# EAGLE design gtia_adapter (EAGLE 7.3.0)
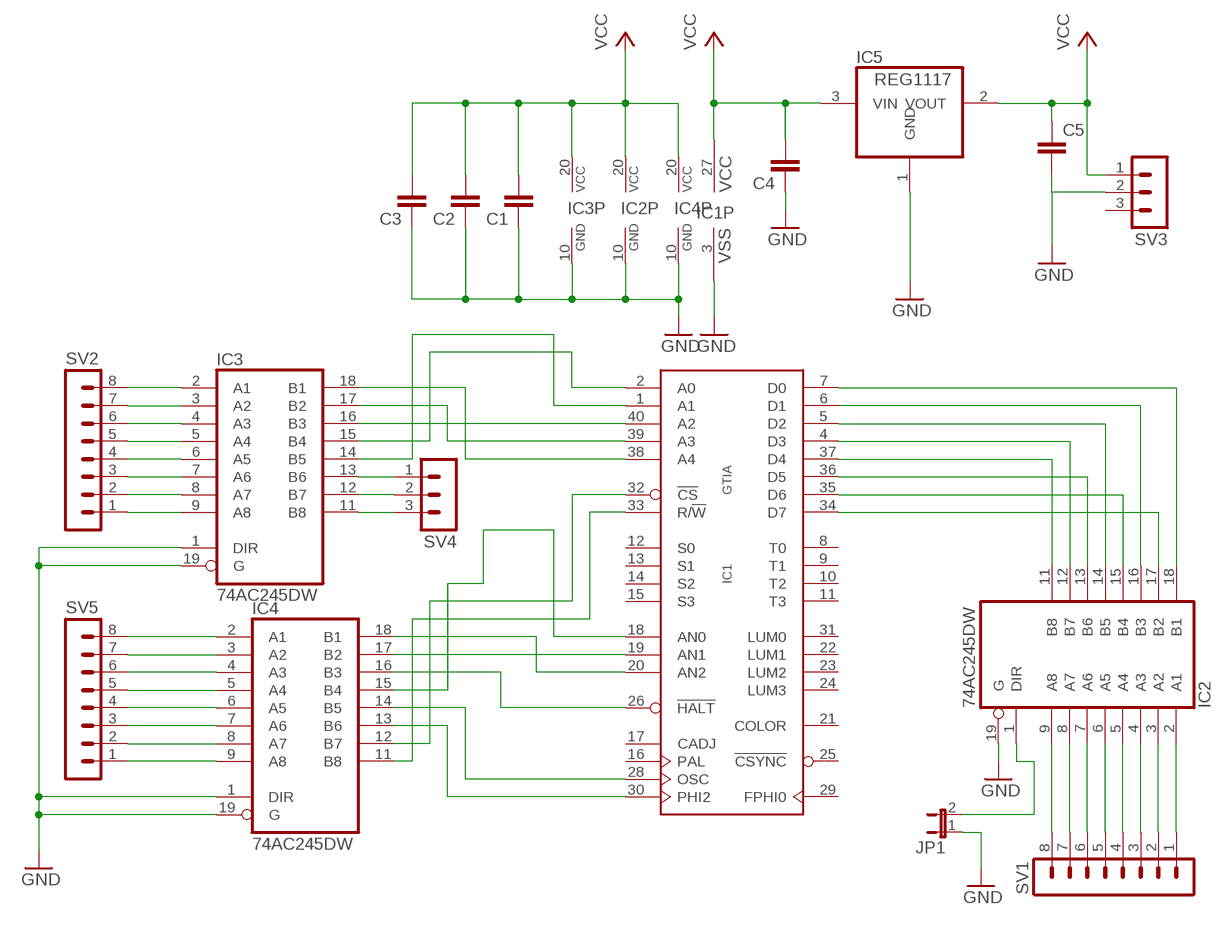
[diagram p0: schematic, sheet 1]

## Parts
C1  C-EUC1206  [C1206]
C2  C-EUC1206  [C1206]
C3  C-EUC1206  [C1206]
C4  C-EUC1206  [C1206]
C5  C-EUC1206  [C1206]
IC1  GTIA  [DIL40]
IC2  74AC245DW  [SO20W]
IC3  74AC245DW  [SO20W]
IC4  74AC245DW  [SO20W]
IC5  REG1117  [SOT223]
JP1  JP1E  [JP1]
SV1  MA08-1  [MA08-1]
SV2  MA08-1  [MA08-1]
SV3  MA03-1  [MA03-1]
SV4  MA03-1  [MA03-1]
SV5  MA08-1  [MA08-1]

## Nets
3.3V_VCC: C1.2 C2.2 C3.2 C5.1 IC2.20(VCC) IC3.20(VCC) IC4.20(VCC) IC5.2(VOUT) SV3.1 ; supply symbol labelled VCC
5V_VCC: C4.2 IC1.27(VCC) IC5.3(VIN) ; supply symbol labelled VCC
GND: C1.1 C2.1 C3.1 C4.1 C5.2 IC1.3(VSS) IC2.10(GND) IC2.19(G) IC3.1(DIR) IC3.10(GND) IC3.19(G) IC4.1(DIR) IC4.10(GND) IC4.19(G) IC5.1(GND) JP1.1 SV3.2
N$1: IC1.18(AN0) IC4.15(B4)
N$2: IC1.19(AN1) IC4.17(B2)
N$3: IC1.20(AN2) IC4.18(B1)
N$4: IC1.2(A0) IC3.15(B4)
N$5: IC1.1(A1) IC3.14(B5)
N$6: IC1.7(D0) IC2.18(B1)
N$7: IC1.6(D1) IC2.16(B3)
N$8: IC1.35(D6) IC2.15(B4)
N$9: IC1.36(D5) IC2.13(B6)
N$10: IC1.4(D3) IC2.12(B7)
N$11: IC1.5(D2) IC2.14(B5)
N$12: IC1.39(A3) IC3.17(B2)
N$13: IC1.37(D4) IC2.11(B8)
N$14: IC1.40(A2) IC3.16(B3)
N$15: IC2.2(A1) SV1.1
N$16: IC2.3(A2) SV1.2
N$17: IC1.33(R/!W) IC4.11(B8)
N$18: IC1.32(!CS) IC4.12(B7)
N$19: IC2.4(A3) SV1.3
N$20: IC1.26(!HALT) IC4.16(B3)
N$21: IC2.5(A4) SV1.4
N$22: IC2.6(A5) SV1.5
N$23: IC2.7(A6) SV1.6
N$24: IC2.8(A7) SV1.7
N$25: IC2.9(A8) SV1.8
N$26: IC1.38(A4) IC3.18(B1)
N$27: IC3.13(B6) SV4.1
N$28: IC1.34(D7) IC2.17(B2)
N$29: IC3.12(B7) SV4.2
N$30: IC3.11(B8) SV4.3
N$31: IC3.2(A1) SV2.8
N$32: IC3.3(A2) SV2.7
N$33: IC3.4(A3) SV2.6
N$34: IC3.5(A4) SV2.5
N$35: IC3.6(A5) SV2.4
N$36: IC1.28(OSC) IC4.14(B5)
N$37: IC1.30(PHI2) IC4.13(B6)
N$38: IC3.7(A6) SV2.3
N$39: IC3.8(A7) SV2.2
N$40: IC3.9(A8) SV2.1
N$41: IC4.2(A1) SV5.8
N$42: IC4.3(A2) SV5.7
N$43: IC4.4(A3) SV5.6
N$44: IC4.5(A4) SV5.5
N$45: IC4.6(A5) SV5.4
N$46: IC4.7(A6) SV5.3
N$47: IC4.8(A7) SV5.2
N$48: IC4.9(A8) SV5.1
N$49: IC2.1(DIR) JP1.2
Unconnected: IC1.8(T0) IC1.9(T1) IC1.10(T2) IC1.11(T3) IC1.12(S0) IC1.13(S1) IC1.14(S2) IC1.15(S3) IC1.16(PAL) IC1.17(CADJ) IC1.21(COLOR) IC1.22(LUM1) IC1.23(LUM2) IC1.24(LUM3) IC1.25(!CSYNC) IC1.29(FPHI0) IC1.31(LUM0) SV3.3

## Library data of the parts
C1-C5 = rcl:C-EU: CAPACITOR, European symbol
IC1 = eagle-6.5.0-atari:GTIA: GTIA
IC2-IC4 = 74xx-eu:74*245: Octal BUS TRANSCEIVER, 3-state
IC5 = burr-brown:REG1117: 800mA and 1A Low Dropout (LDO) Positive Regulator 1.8V, 2.5V, 2.85V, 3.3V, 5V, and Adj; MPN: REG1117; OC_FARNELL: 1097566; OC_NEWARK: 14P6981
JP1 = jumper:JP1E: JUMPER
SV1 SV2 SV5 = con-lstb:MA08-1: PIN HEADER; OC_FARNELL: unknown; OC_NEWARK: unknown
SV3 SV4 = con-lstb:MA03-1: PIN HEADER; OC_FARNELL: unknown; OC_NEWARK: unknown

## Board
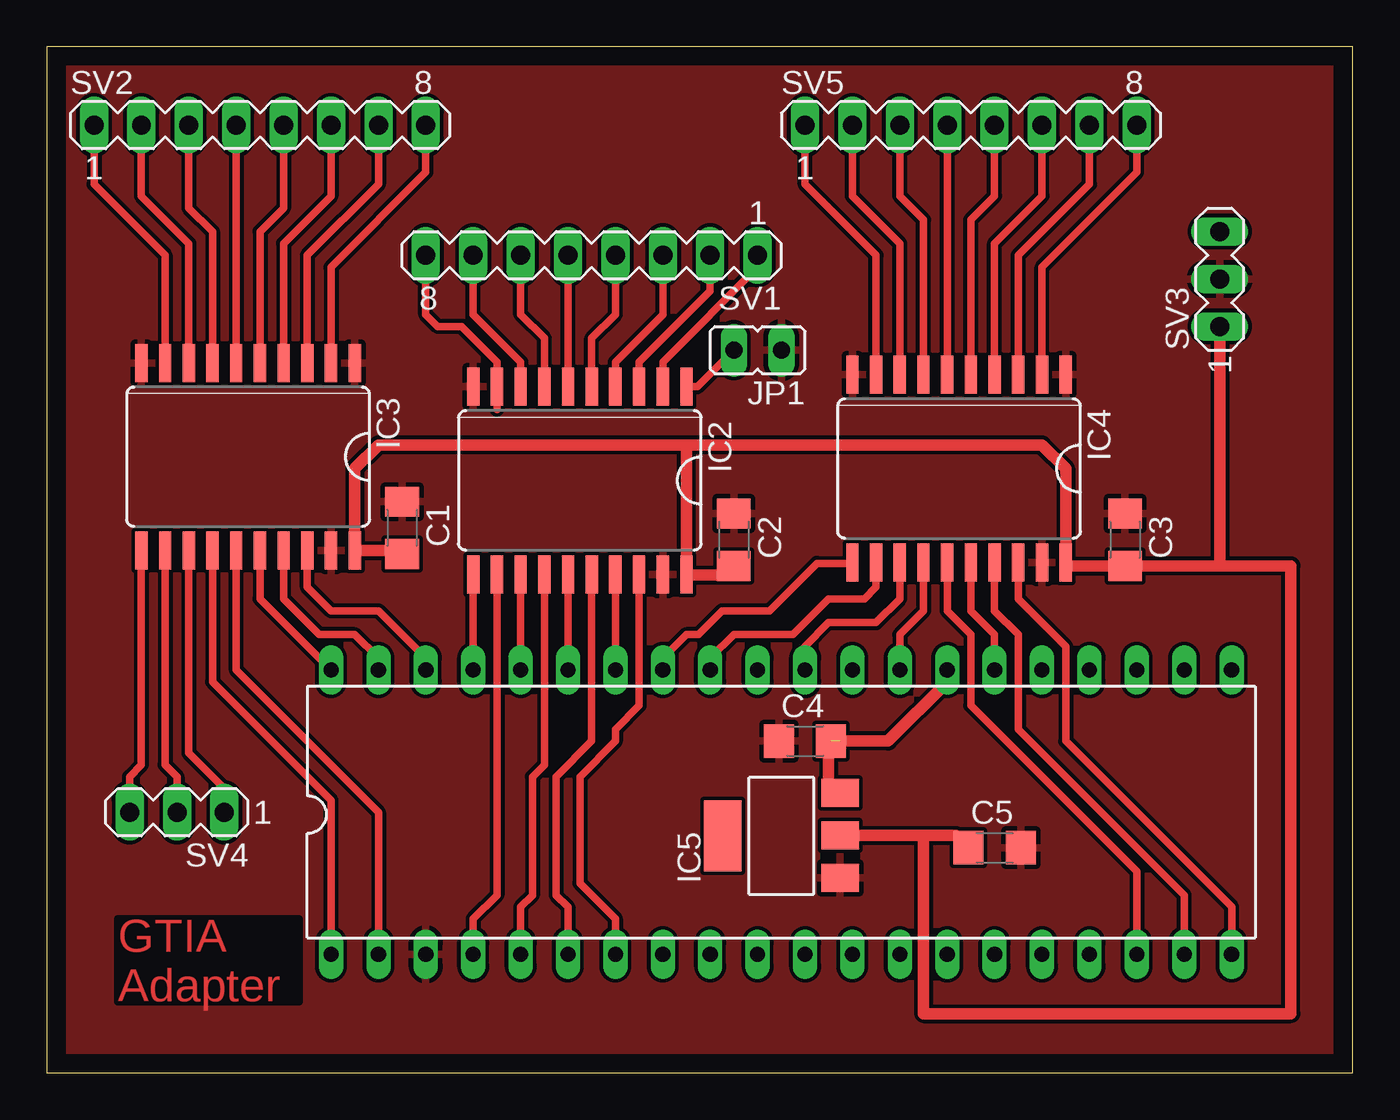
[diagram p1: board, top side]

Size 70 x 55 mm. Coordinates in mm from the lower left corner, seen from the top.
Outline: 0,0 70,0 70,55 0,55 0,0
Copper layers (1*16): Top 0.035mm / dielectric 1.5mm / Bottom 0.035mm
Design rules "default": minimum track width 10mil, minimum drill 24mil, track to track 8mil, track to pad 8mil, pad to pad 8mil, via to via 8mil, smd to smd 8mil, copper to edge 40mil, drill to drill 8mil, minimum pad ring 10mil, minimum via ring 8mil, stop-mask expansion 4mil, vias tented up to drill 0mil, thermal gap 10mil

### Footprints (pad centres in the part's own frame; a part is rotated, then mirrored left to right if it is on the bottom)
C1206 = smd 1.6 x 1.8: 1 -1.4,0; 2 1.4,0
DIL40 = drill 0.813 long: 1 -24.13,-7.62; 2 -21.59,-7.62; 3 -19.05,-7.62; 4 -16.51,-7.62; 5 -13.97,-7.62; 6 -11.43,-7.62; 7 -8.89,-7.62; 8 -6.35,-7.62; 9 -3.81,-7.62; 10 -1.27,-7.62; 11 1.27,-7.62; 12 3.81,-7.62; 13 6.35,-7.62; 14 8.89,-7.62; 15 11.43,-7.62; 16 13.97,-7.62; 17 16.51,-7.62; 18 19.05,-7.62; 19 21.59,-7.62; 20 24.13,-7.62; 21 24.13,7.62; 22 21.59,7.62; 23 19.05,7.62; 24 16.51,7.62; 25 13.97,7.62; 26 11.43,7.62; 27 8.89,7.62; 28 6.35,7.62; 29 3.81,7.62; 30 1.27,7.62; 31 -1.27,7.62; 32 -3.81,7.62; 33 -6.35,7.62; 34 -8.89,7.62; 35 -11.43,7.62; 36 -13.97,7.62; 37 -16.51,7.62; 38 -19.05,7.62; 39 -21.59,7.62; 40 -24.13,7.62
SO20W = smd 0.66 x 2.032: 1 -5.715,-5.029; 2 -4.445,-5.029; 3 -3.175,-5.029; 4 -1.905,-5.029; 5 -0.635,-5.029; 6 0.635,-5.029; 7 1.905,-5.029; 8 3.175,-5.029; 9 4.445,-5.029; 10 5.715,-5.029; 11 5.715,5.029; 12 4.445,5.029; 13 3.175,5.029; 14 1.905,5.029; 15 0.635,5.029; 16 -0.635,5.029; 17 -1.905,5.029; 18 -3.175,5.029; 19 -4.445,5.029; 20 -5.715,5.029
SOT223 = smd 1.499 x 2.007: 1 -2.261,-3.15; 2 0.025,-3.15; 3 2.311,-3.15 | smd 3.81 x 2.007: 4 0,3.15
JP1 = drill 0.914 long: 1 0,-1.27; 2 0,1.27
MA08-1 = drill 1.016 long: 1 -8.89,0; 2 -6.35,0; 3 -3.81,0; 4 -1.27,0; 5 1.27,0; 6 3.81,0; 7 6.35,0; 8 8.89,0
MA03-1 = drill 1.016 long: 1 -2.54,0; 2 0,0; 3 2.54,0

### Placement (x,y rotation side)
C1  19.05,29.21 270 top
C2  36.83,28.57 270 top
C3  57.78,28.57 270 top
C4  40.64,17.78 0 top
C5  50.8,12.06 0 top
IC1  39.37,13.97 0 top
IC2  28.57,31.75 180 top
IC3  10.79,33.02 180 top
IC4  48.9,32.38 180 top
IC5  39.37,12.7 90 top
JP1  38.1,38.73 90 top
SV1  29.21,43.81 180 top
SV2  11.43,50.8 0 top
SV3  62.87,42.55 90 top
SV4  6.99,13.97 180 top
SV5  49.53,50.8 0 top

### Tracks (layer width: path | path; a pad name or v marks a point on that pad's centre or on a via)
3.3V_VCC
  Top 0.406: IC2.20 34.34,26.67
  Top 0.61: 34.34,26.67 36.83,26.67 C2.2 | 34.29,33.66 53.34,33.66 54.61,32.38 IC4.20 54.79,27.18 C3.2 | 34.29,33.66 17.78,33.66 16.51,32.38 IC3.20 18.87,27.99 C1.2 | IC2.20 34.29,33.66 | C5.1 48.74,12.72 IC5.2 46.99,12.72 46.99,3.17 66.67,3.17 66.67,27.18 62.87,27.18 | 57.78,26.67 C3.2 | 62.87,27.18 C3.2 | SV3.1 62.87,27.18
5V_VCC  (1 unrouted)
  Top 0.61: IC1.27 48.26,20.95 45.09,17.78 42.55,17.78 41.91,17.14 41.91,15.62 IC5.3
GND
  pour Top: 0,55.24 70.48,55.24 70.48,0 0,0
N$1
  Top 0.406: IC4.15 48.26,24.77 49.53,23.5 49.53,19.68 58.42,10.79 IC1.18
N$2
  Top 0.406: IC1.19 60.96,9.53 52.07,18.41 52.07,23.5 50.8,24.77 IC4.17
N$3
  Top 0.406: IC1.20 63.5,8.89 54.61,17.78 54.61,22.86 52.07,25.4 IC4.18
N$4
  Top 0.406: 17.78,5.71 IC1.2 17.78,13.97 10.16,21.59 IC3.15
N$5
  Top 0.406: IC1.1 15.24,14.61 8.89,20.95 IC3.14
N$6
  Top 0.406: IC2.18 31.75,19.68 30.48,18.41 30.48,17.78 28.57,15.88 28.57,10.16 30.48,8.26 IC1.7
N$7
  Top 0.406: 29.21,27.3 IC2.16 29.21,17.78 27.3,15.88 27.3,9.53 27.94,8.89 IC1.6
N$8
  Top 0.406: IC1.35 IC2.15
N$9
  Top 0.406: IC1.36 IC2.13
N$10
  Top 0.406: IC2.12 24.13,9.53 22.86,8.26 IC1.4
N$11
  Top 0.406: IC2.14 26.67,16.51 26.04,15.88 26.04,9.53 25.4,8.89 IC1.5
N$12
  Top 0.406: IC1.39 17.78,22.23 16.51,23.5 14.61,23.5 12.7,25.4 IC3.17
N$13
  Top 0.406: IC1.37 IC2.11
N$14
  Top 0.406: IC3.16 11.43,25.4 IC1.40
N$15
  Top 0.406: 33.02,36.2 IC2.2 33.02,38.1 38.1,43.18 SV1.1
N$16
  Top 0.406: IC2.3 31.75,38.1 35.56,41.91 SV1.2
N$17
  Top 0.406: IC4.11 43.13,27.3 41.27,27.3 38.73,24.77 36.2,24.77 34.92,23.5 34.29,23.5 33.02,22.23 IC1.33
N$18
  Top 0.406: IC4.12 44.45,26.04 43.81,25.4 41.91,25.4 40.01,23.5 36.83,23.5 35.56,22.23 IC1.32
N$19
  Top 0.406: IC2.4 30.48,38.1 33.02,40.64 SV1.3
N$20
  Top 0.406: IC1.26 50.8,23.5 49.53,24.77 IC4.16
N$21
  Top 0.406: IC2.5 29.21,39.37 30.48,40.64 SV1.4
N$22
  Top 0.406: IC2.6 SV1.5
N$23
  Top 0.406: 26.67,36.2 IC2.7 26.67,39.37 25.4,40.64 SV1.6
N$24
  Top 0.406: IC2.8 25.4,38.1 22.86,40.64 SV1.7
N$25
  Top 0.406: 24.13,35.56 IC2.9 24.13,38.1 22.23,40.01 20.95,40.01 20.32,40.64 SV1.8
N$26
  Top 0.406: IC1.38 20.32,22.23 17.78,24.77 15.24,24.77 13.97,26.04 IC3.18
N$27
  Top 0.406: IC3.13 7.62,17.14 9.53,15.24 SV4.1
N$28
  Top 0.406: IC1.34 IC2.17
N$29
  Top 0.406: IC3.12 6.35,16.51 6.99,15.88 SV4.2
N$30
  Top 0.406: IC3.11 5.08,16.51 4.45,15.88 SV4.3
N$31
  Top 0.406: SV2.8 20.32,48.26 15.24,43.18 IC3.2
N$32
  Top 0.406: SV2.7 17.78,47.62 13.97,43.81 IC3.3
N$33
  Top 0.406: SV2.6 15.24,46.99 12.7,44.45 IC3.4
N$34
  Top 0.406: SV2.5 12.7,46.35 11.43,45.09 IC3.5
N$35
  Top 0.406: SV2.4 IC3.6
N$36
  Top 0.406: IC4.14 46.99,24.77 45.72,23.5 IC1.28
N$37
  Top 0.406: IC1.30 40.64,22.86 41.91,24.13 44.45,24.13 45.72,25.4 IC4.13
N$38
  Top 0.406: SV2.3 7.62,46.35 8.89,45.09 IC3.7
N$39
  Top 0.406: SV2.2 5.08,46.99 7.62,44.45 IC3.8
N$40
  Top 0.406: SV2.1 2.54,47.62 6.35,43.81 IC3.9
N$41
  Top 0.406: IC4.2 53.34,43.18 58.42,48.26 SV5.8
N$42
  Top 0.406: IC4.3 52.07,43.81 55.88,47.62 SV5.7
N$43
  Top 0.406: 50.8,36.83 IC4.4 50.8,44.45 53.34,46.99 SV5.6
N$44
  Top 0.406: IC4.5 49.53,45.72 50.8,46.99 SV5.5
N$45
  Top 0.406: IC4.6 SV5.4
N$46
  Top 0.406: IC4.7 46.99,45.72 45.72,46.99 SV5.3
N$47
  Top 0.406: IC4.8 45.72,44.45 43.18,46.99 SV5.2
N$48
  Top 0.406: IC4.9 44.45,43.81 40.64,47.62 SV5.1
N$49
  Top 0.406: IC2.1 34.87,36.78 JP1.2

### Text on the board
Top: GTIA / Adapter